# Altium schematic sheet 02.SchDoc
size 297 x 209 mm
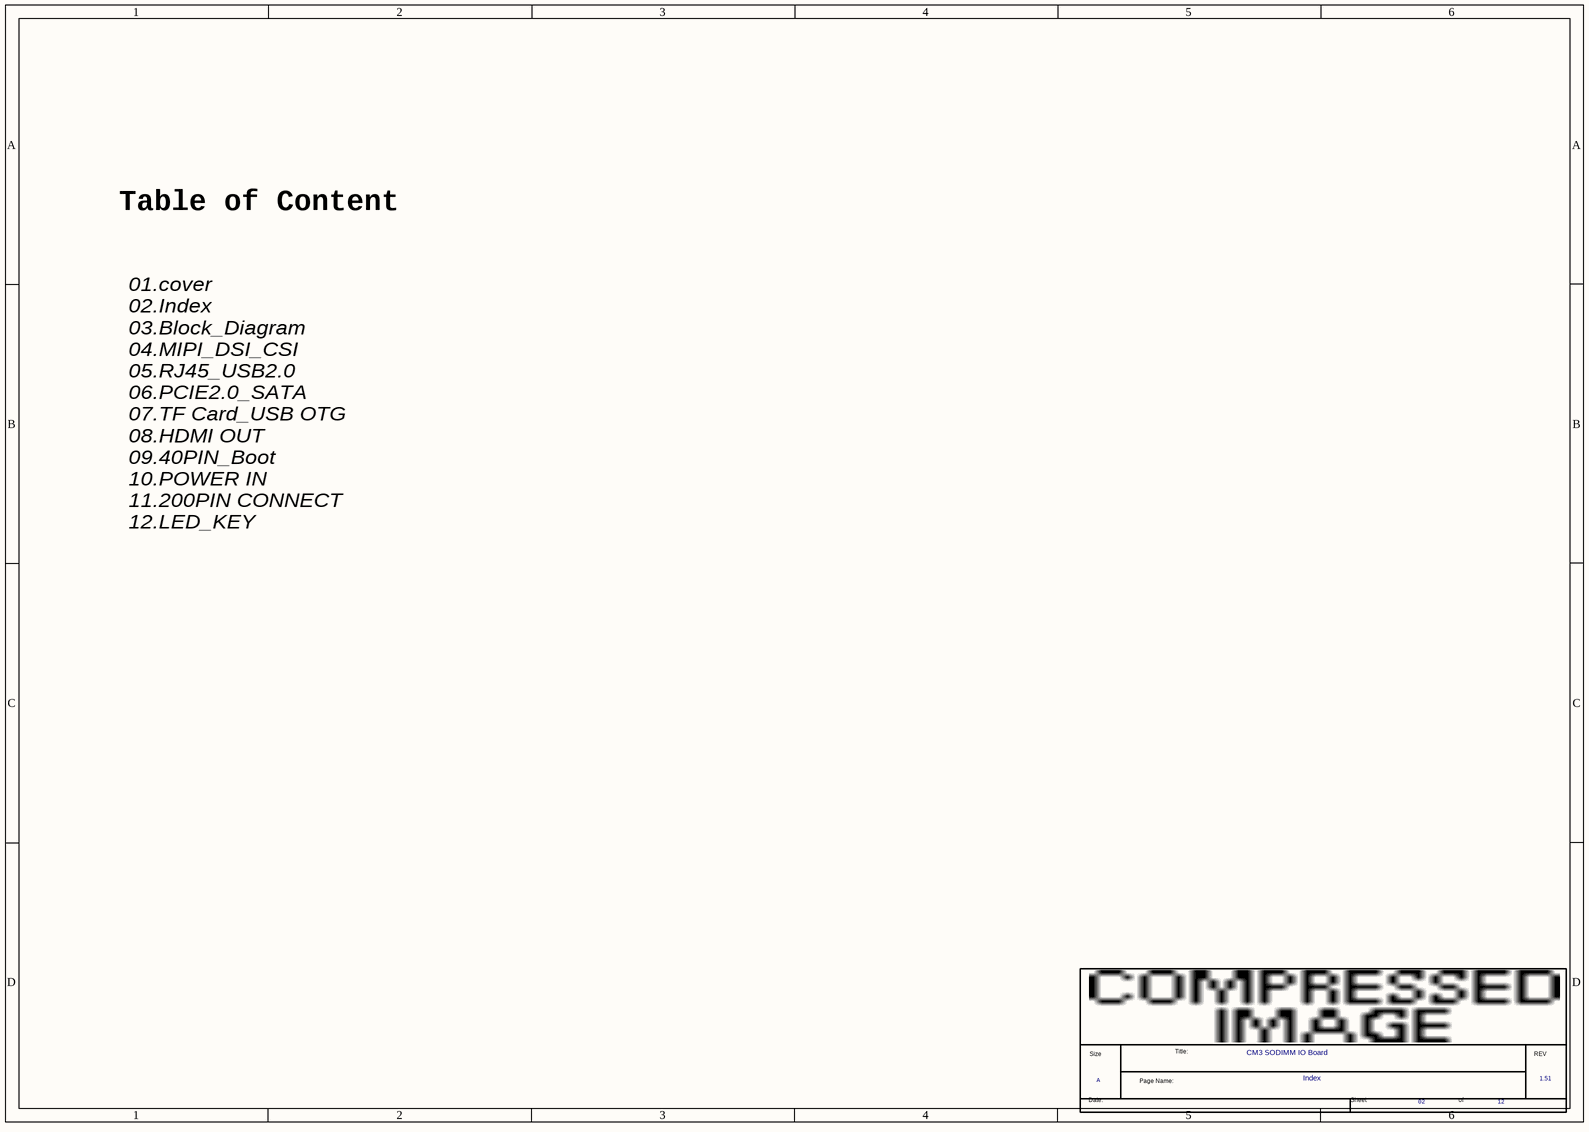
[diagram p0: 02.SchDoc]

## Parts
*  Page Count: 12  Page Number: 02  Page Size: A  Title: CM3 SODIMM IO Board  RevCode: 1.51  Doc: Index  (hidden comment: radxa_1010)  (graphical)

## Notes on the sheet
- Table of Content
- 01.cover
  02.Index
  03.Block_Diagram
  04.MIPI_DSI_CSI
  05.RJ45_USB2.0
  06.PCIE2.0_SATA
  07.TF Card_USB OTG
  08.HDMI OUT
  09.40PIN_Boot
  10.POWER IN
  11.200PIN CONNECT
  12.LED_KEY
- (in symbol radxa_1010) Title:; Size; REV; Page Name:; Date:; Sheet; of

## Library data of the parts
* = radxa_1010: Page Create Date: March  8, 1995